# EAGLE design Battery_monitor_fix (EAGLE 7.6.0)
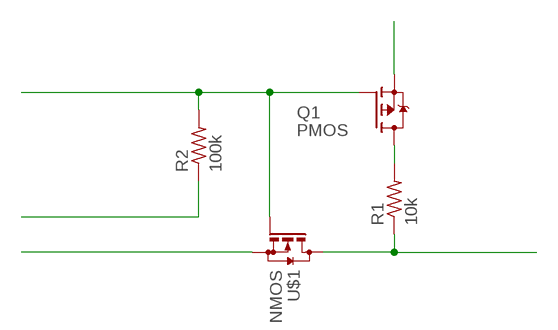
[diagram p0: schematic, sheet 1]

## Parts
Q1  PMOS  [SC70]
R1  10k  R-US_0402_REAL  [0402_REAL]
R2  100k  R-US_0402_REAL  [0402_REAL]
U$1  NMOS  [SC70]

## Nets
N$1: Q1.G R2.2 U$1.G
N$2: Q1.S
N$3: Q1.D R1.2
N$4: R1.1 U$1.D
N$5: U$1.S
N$6: R2.1

## Library data of the parts
Q1 = Custom_Library:PMOS
R1 R2 = rcl:R-US_: RESISTOR, American symbol
U$1 = Custom_Library:NMOS

## Board
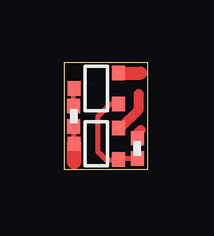
[diagram p1: board, top side]

Size 3.5 x 4.45 mm. Coordinates in mm from the lower left corner, seen from the top.
Outline: 0,0 3.5,0 3.5,4.45 0,4.45 0,0
Copper layers (1*16): Top 0.035mm / dielectric 1.6mm / Bottom 0.035mm
Design rules "Elecrow_2-layer_PCB_eagle_rule": minimum track width 6mil, minimum drill 12mil, track to track 6mil, track to pad 6mil, pad to pad 6mil, via to via 8mil, smd to smd 0mil, copper to edge 20mil, drill to drill 10mil, minimum pad ring 6mil, minimum via ring 6mil, stop-mask expansion 0mil, vias tented up to drill 100mil, thermal gap 10mil

### Footprints (pad centres in the part's own frame; a part is rotated, then mirrored left to right if it is on the bottom)
SC70 = smd 0.6 x 0.55: D 0,0.925; G -0.65,-0.925; S 0.65,-0.925
0402_REAL = smd 0.6 x 0.55: 1 -0.43,0.01; 2 0.42,0.01

### Placement (x,y rotation side)
Q1  1.34,3.37 90 top
R1  0.4,2.22 90 top
R2  3.05,0.87 270 top
U$1  1.34,1.07 90 top

### Tracks (layer width: path | path; a pad name or v marks a point on that pad's centre or on a via)
N$1
  Top 0.205: R2.2 2.27,0.45 U$1.G 2.25,0.4 1.75,0.4 1.4,0.75 1.4,2.2 1.92,2.72 Q1.G
N$2  (1 unrouted)
  Top 0.205: Q1.S 2.42,4.02
  Top 0.55: 2.25,4.01 3.2,4.01
N$3
  Top 0.205: R1.2 0.39,3.35 Q1.D
N$4  (1 unrouted)
  Top 0.205: R1.1 0.39,1.09 U$1.D
  Top 0.6: U$1.D 0.42,0.33
N$5  (1 unrouted)
  Top 0.406: 2.38,1.75 3.12,2.49 3.12,3.15
N$6  (1 unrouted)
  Top 0.406: 3.06,1.34 3.06,1.51 3.2,1.65